# Altium schematic sheet F4_micro_FMU_REV_1.SchDoc
size A2; DrawnBy: Philip Rowse; SheetNumber: 1; SheetTotal: 10
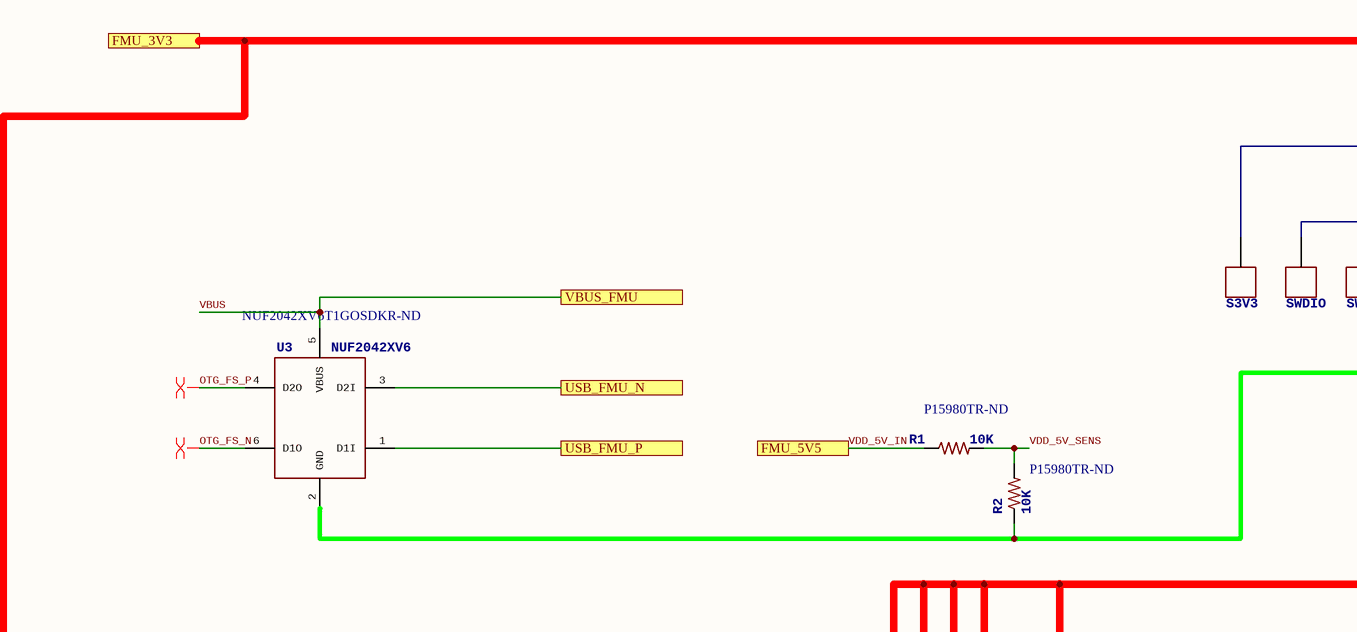
[diagram p0: F4_micro_FMU_REV_1.SchDoc, top left]
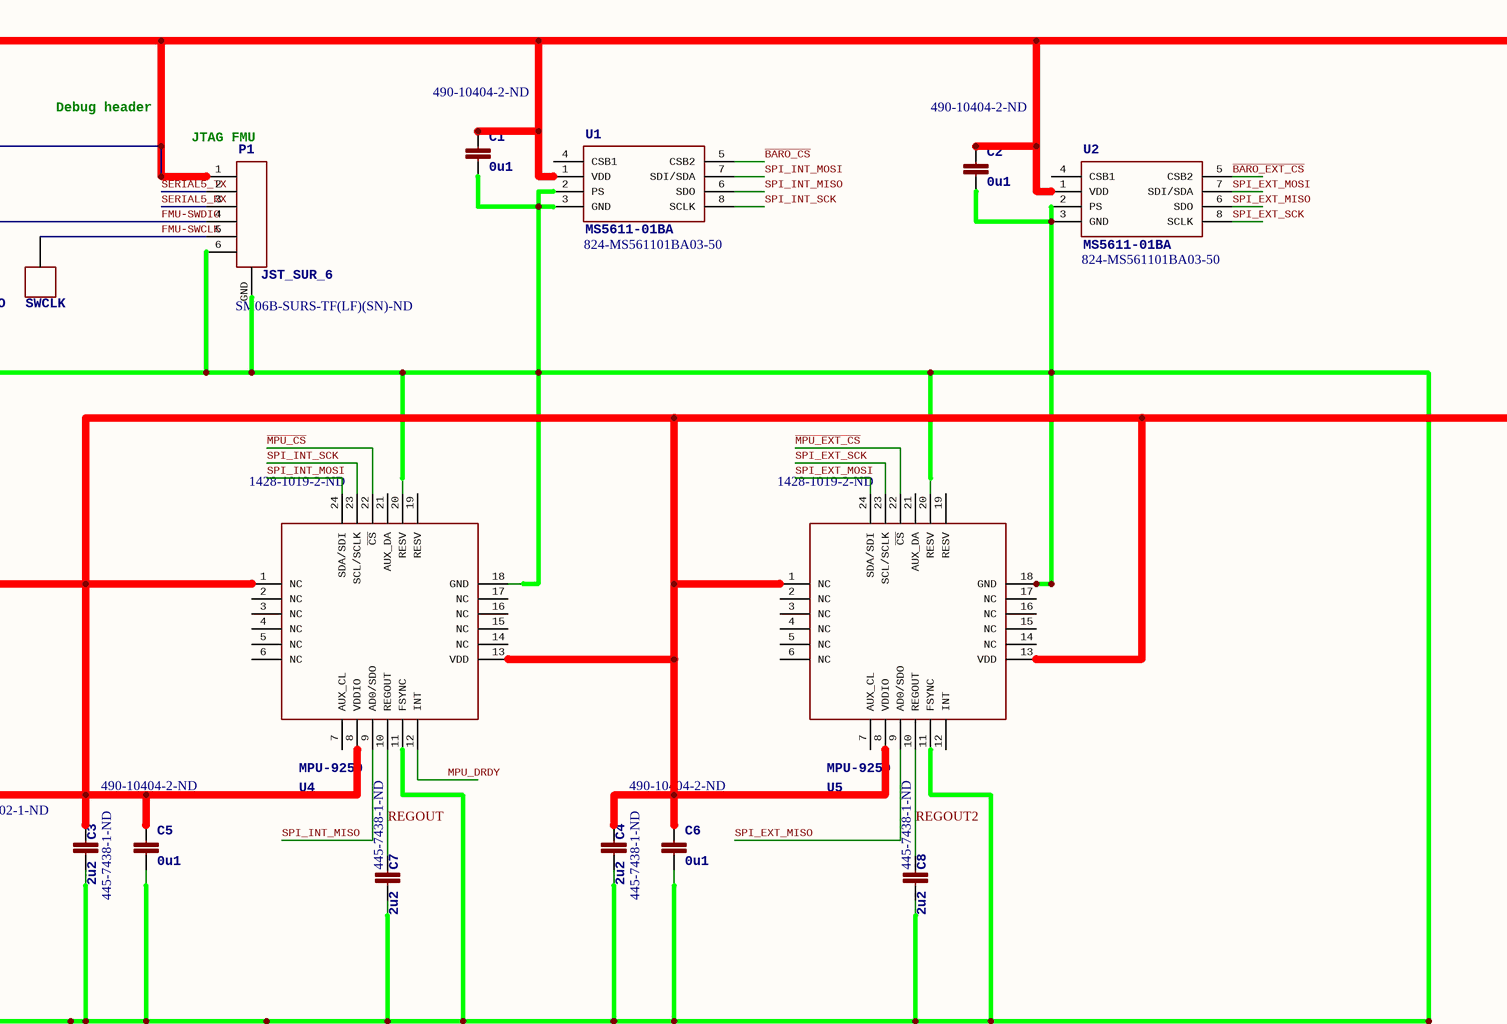
[diagram p1: F4_micro_FMU_REV_1.SchDoc, top right]
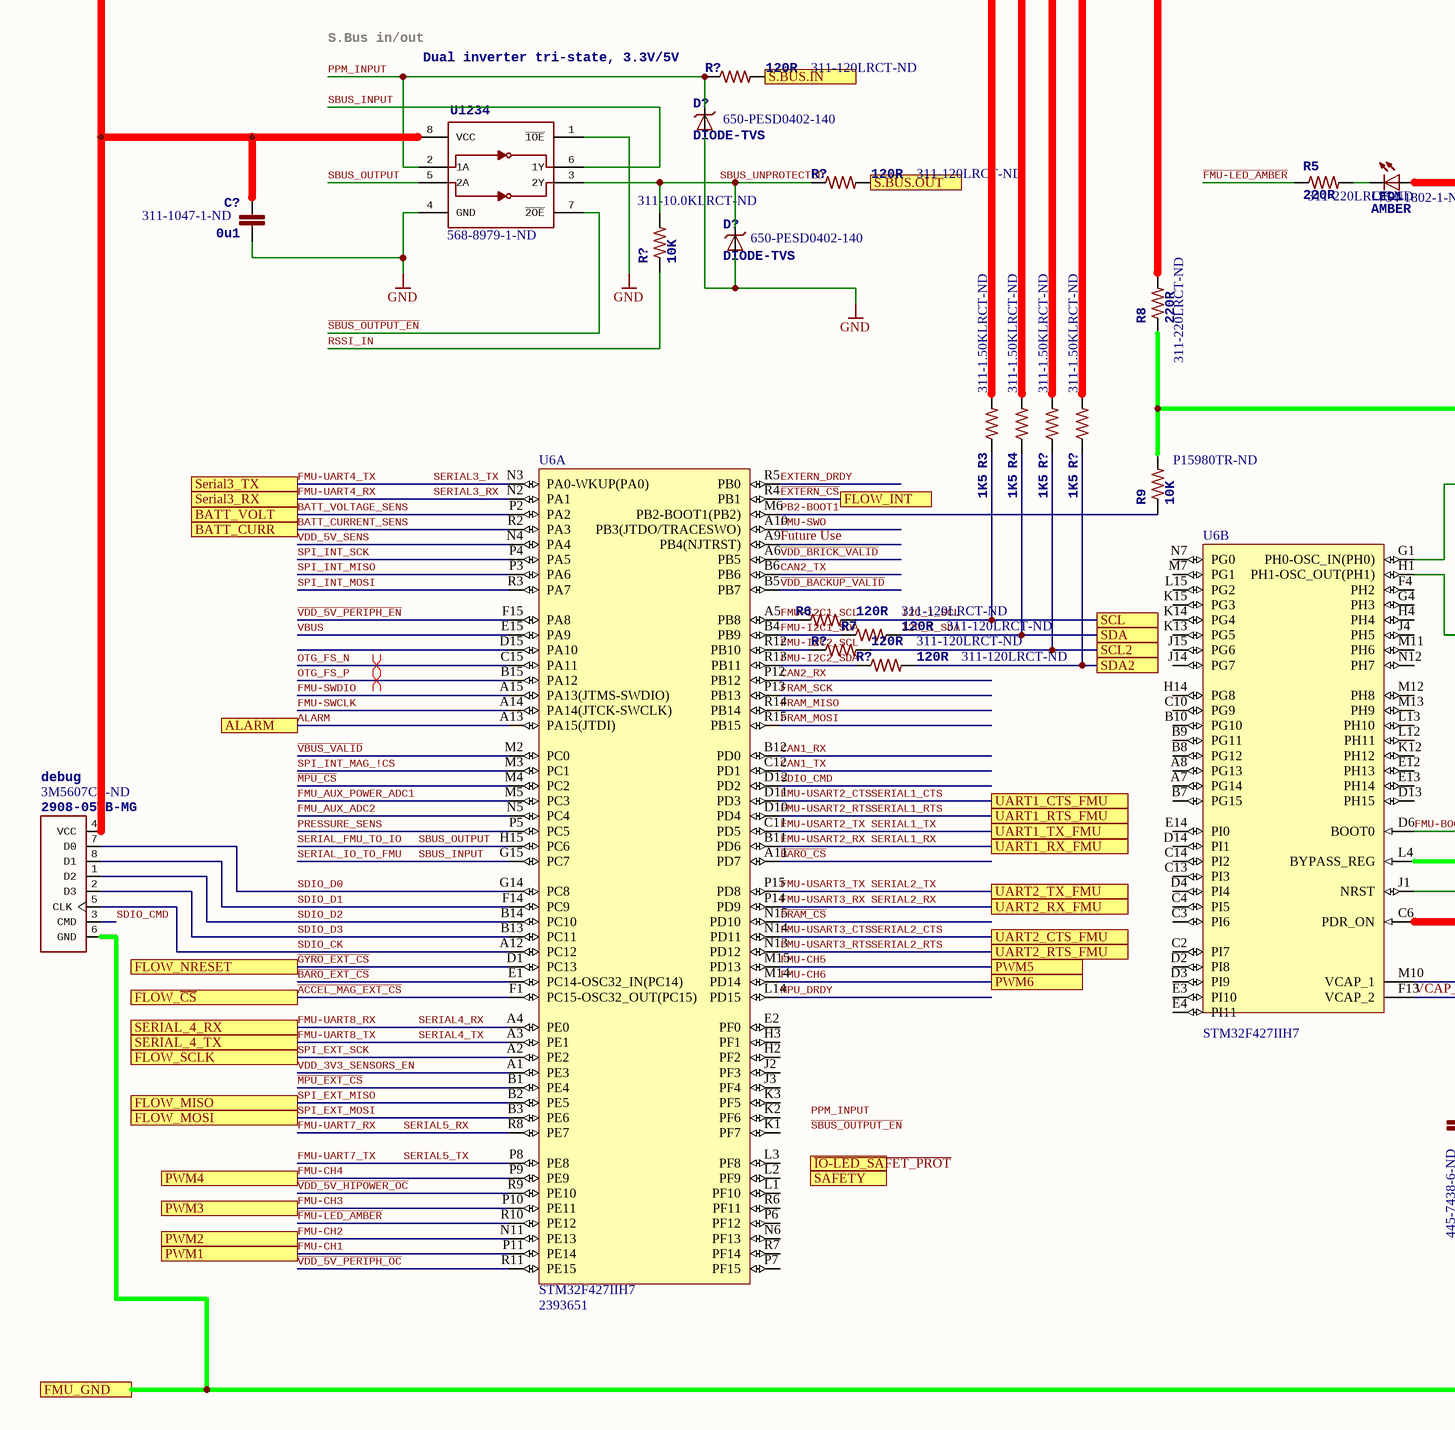
[diagram p2: F4_micro_FMU_REV_1.SchDoc, bottom left]
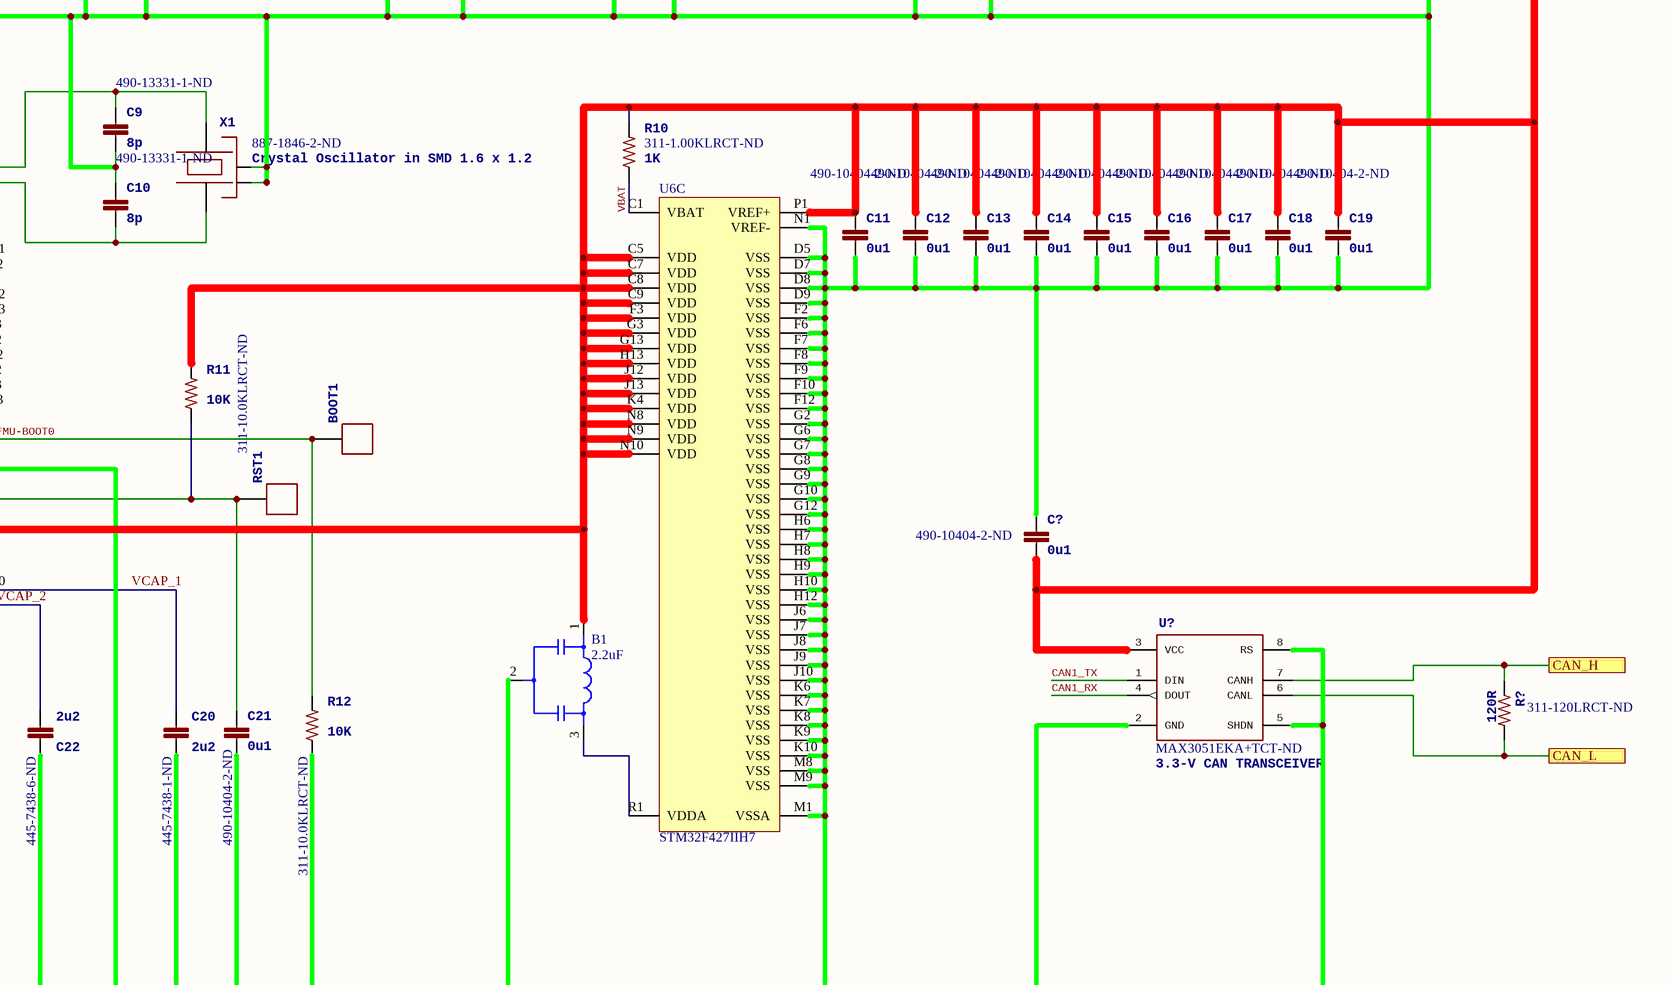
[diagram p3: F4_micro_FMU_REV_1.SchDoc, bottom right]

## Parts
(Parts that share a designator on the sheet are numbered #1, #2 ... from top to bottom, then left to right.)
B1  value 2.2uF  [NFM18CC]  (hidden comment: Filter)
BOOT1  (no value)  [PAD.04X.04]  (no BOM)
C1  0u1  Supplier Part Number 1: 490-10404-2-ND  [0201-cap]
C2  0u1  Supplier Part Number 1: 490-10404-2-ND  [0201-cap]
C3  2u2  Supplier Part Number 1: 445-7438-1-ND  [0603-CAP]
C4  2u2  Supplier Part Number 1: 445-7438-1-ND  [0603-CAP]
C5  0u1  Supplier Part Number 1: 490-10404-2-ND  [0201-cap]
C6  0u1  Supplier Part Number 1: 490-10404-2-ND  [0201-cap]
C7  2u2  Supplier Part Number 1: 445-7438-1-ND  [0603-CAP]
C8  2u2  Supplier Part Number 1: 445-7438-1-ND  [0603-CAP]
C9  8p  Supplier Part Number 1: 490-13331-1-ND  [0201-cap]
C10  8p  Supplier Part Number 1: 490-13331-1-ND  [0201-cap]
C11  0u1  Supplier Part Number 1: 490-10404-2-ND  [0201-cap]
C12  0u1  Supplier Part Number 1: 490-10404-2-ND  [0201-cap]
C13  0u1  Supplier Part Number 1: 490-10404-2-ND  [0201-cap]
C14  0u1  Supplier Part Number 1: 490-10404-2-ND  [0201-cap]
C15  0u1  Supplier Part Number 1: 490-10404-2-ND  [0201-cap]
C16  0u1  Supplier Part Number 1: 490-10404-2-ND  [0201-cap]
C17  0u1  Supplier Part Number 1: 490-10404-2-ND  [0201-cap]
C18  0u1  Supplier Part Number 1: 490-10404-2-ND  [0201-cap]
C19  0u1  Supplier Part Number 1: 490-10404-2-ND  [0201-cap]
C20  2u2  Supplier Part Number 1: 445-7438-1-ND  [0603-CAP]
C21  0u1  Supplier Part Number 1: 490-10404-2-ND  [0201-cap]
C22  2u2  Supplier Part Number 1: 445-7438-6-ND  [0603-CAP]
C?#1  0u1  Supplier Part Number 1: 311-1047-1-ND  [0402-CAP]
C?#2  0u1  Supplier Part Number 1: 490-10404-2-ND  [0201-cap]
D?#1  DIODE-TVS  Supplier Part Number 1: 650-PESD0402-140  [0402-TVS]
D?#2  DIODE-TVS  Supplier Part Number 1: 650-PESD0402-140  [0402-TVS]
debug  2908-05WB-MG  Supplier Part Number 1: 3M5607CT-ND  [MICROSD]
LED1  AMBER  Supplier Part Number 1: 754-1802-1-ND  [0603-LED]
P1  JST_SUR_6  Supplier Part Number 1: SM06B-SURS-TF(LF)(SN)-ND  [JST_SUR_H6]
R1  10K  Supplier Part Number 1: P15980TR-ND  [0201-RES]
R2  10K  Supplier Part Number 1: P15980TR-ND  [0201-RES]
R3  1K5  Supplier Part Number 1: 311-1.50KLRCT-ND  [0402-RES]
R4  1K5  Supplier Part Number 1: 311-1.50KLRCT-ND  [0402-RES]
R5  220R  Supplier Part Number 1: 311-220LRCT-ND  [0402-RES]
R6  120R  Supplier Part Number 1: 311-120LRCT-ND  [0402-RES]
R7  120R  Supplier Part Number 1: 311-120LRCT-ND  [0402-RES]
R8  220R  Supplier Part Number 1: 311-220LRCT-ND  [0402-RES]  (no BOM)
R9  10K  Supplier Part Number 1: P15980TR-ND  [0201-RES]
R10  1K  Supplier Part Number 1: 311-1.00KLRCT-ND  [0402-RES]
R11  10K  Supplier Part Number 1: 311-10.0KLRCT-ND  [0402-RES]
R12  10K  Supplier Part Number 1: 311-10.0KLRCT-ND  [0402-RES]
R?#1  120R  Supplier Part Number 1: 311-120LRCT-ND  [0402-RES]
R?#2  120R  Supplier Part Number 1: 311-120LRCT-ND  [0402-RES]
R?#3  10K  Supplier Part Number 1: 311-10.0KLRCT-ND  [0402-RES]
R?#4  1K5  Supplier Part Number 1: 311-1.50KLRCT-ND  [0402-RES]
R?#5  1K5  Supplier Part Number 1: 311-1.50KLRCT-ND  [0402-RES]
R?#6  120R  Supplier Part Number 1: 311-120LRCT-ND  [0402-RES]
R?#7  120R  Supplier Part Number 1: 311-120LRCT-ND  [0402-RES]
R?#8  120R  Supplier Part Number 1: 311-120LRCT-ND  [0402-RES]
RST1  (no value)  [PAD.04X.04]  (no BOM)
S3V3  PAD.04  [Battery Term]  (value not drawn)  (no BOM)
SWCLK  PAD.04  [Battery Term]  (value not drawn)  (no BOM)
SWDIO  PAD.04  [Battery Term]  (value not drawn)  (no BOM)
U1  MS5611-01BA  Supplier Part Number 1: 824-MS561101BA03-50  [MS5611-01BA]
U2  MS5611-01BA  Supplier Part Number 1: 824-MS561101BA03-50  [MS5611-01BA]
U3  NUF2042XV6  Supplier Part Number 1: NUF2042XV6T1GOSDKR-ND  [SOT563-6]
U4  MPU-9250  Supplier Part Number 1: 1428-1019-2-ND  [MPU-9250]
U5  MPU-9250  Supplier Part Number 1: 1428-1019-2-ND  [MPU-9250]
U6  STM32F427IIH7  Supplier Part Number 1: 2393651  [STM-UFBGA176+25]  (parts A,B,C of 3)
U1234  Dual inverter tri-state, 3.3V/5V  Supplier Part Number 1: 568-8979-1-ND  [TSSOP8_SOT505-2]
U?  3.3-V CAN TRANSCEIVER  Supplier Part Number 1: MAX3051EKA+TCT-ND  [SOT23-8]
X1  Crystal Oscillator in SMD 1.6 x 1.2  Supplier Part Number 1: 887-1846-2-ND  [OSCILLATOR-1.6x1.2]

## Ports
ALARM, BATT_CURR, BATT_VOLT, CAN_H, CAN_L, FLOW_INT, FLOW_MISO, FLOW_MOSI, FLOW_NRESET, FLOW_SCLK, FLOW_~{CS}, FMU_3V3, FMU_5V5, FMU_GND, PWM1, PWM2, PWM3, PWM4, PWM5, PWM6, S.BUS.IN, S.BUS.OUT, SAFETY, SCL, SCL2, SDA, SDA2, Serial3_RX, Serial3_TX, SERIAL_4_RX, SERIAL_4_TX, UART1_CTS_FMU, UART1_RTS_FMU, UART1_RX_FMU, UART1_TX_FMU, UART2_CTS_FMU, UART2_RTS_FMU, UART2_RX_FMU, UART2_TX_FMU, USB_FMU_N, USB_FMU_P, VBUS_FMU, ~{IO-LED_SAFET_PROT}

## Nets
GND: C?#1.P$2 D?#1.A D?#2.A U1234.1(~{1OE}) U1234.4(GND)
~{ACCEL_MAG_EXT_CS}: U6.F1(PC15-OSC32_OUT(PC15)) ; port FLOW_~{CS}
ALARM: U6.A13(PA15(JTDI)) ; port ALARM
~{BARO_CS}: U1.5(CSB2) U6.A11(PD7)
~{BARO_EXT_CS}: U2.5(CSB2) U6.E1(PC14-OSC32_IN(PC14))
BATT_CURRENT_SENS: U6.R2(PA3) ; port BATT_CURR
BATT_VOLTAGE_SENS: U6.P2(PA2) ; port BATT_VOLT
CAN1_RX: U6.B12(PD0) U?.4(DOUT)
CAN1_TX: U6.C12(PD1) U?.1(DIN)
CAN2_RX: U6.P12(PB12)
CAN2_TX: U6.B6(PB6)
CAN_H: R?#8.P$1 U?.7(CANH) ; port CAN_H
CAN_L: R?#8.P$2 U?.6(CANL) ; port CAN_L
~{EXTERN_CS}: U6.R4(PB1) ; port FLOW_INT
EXTERN_DRDY: U6.R5(PB0)
~{FMU-LED_AMBER}: R5.1 U6.R10(PE12)
~{FRAM_CS}: U6.N15(PD10)
FMU-BOOT0: BOOT1.1 R12.2 U6.D6(BOOT0)
FMU-CH1: U6.P11(PE14) ; port PWM1
FMU-CH2: U6.N11(PE13) ; port PWM2
FMU-CH3: U6.P10(PE11) ; port PWM3
FMU-CH4: U6.P9(PE9) ; port PWM4
FMU-CH5: U6.M15(PD13) ; port PWM5
FMU-CH6: U6.M14(PD14) ; port PWM6
FMU-I2C1_SCL: R6.1 U6.A5(PB8)
FMU-I2C1_SDA: R7.1 U6.B4(PB9)
FMU-I2C2_SCL: R?#6.1 U6.R12(PB10)
FMU-I2C2_SDA: R?#7.1 U6.R13(PB11)
FMU-SWCLK: P1.5 SWCLK.1 U6.A14(PA14(JTCK-SWCLK))
FMU-SWDIO: P1.4 SWDIO.1 U6.A15(PA13(JTMS-SWDIO))
FMU-SWO: U6.A10(PB3(JTDO/TRACESWO))
FMU-UART4_RX: U6.N2(PA1) ; port Serial3_RX  [also labelled SERIAL3_RX]
FMU-UART4_TX: U6.N3(PA0-WKUP(PA0)) ; port Serial3_TX  [also labelled SERIAL3_TX]
FMU-UART7_RX: P1.3 U6.R8(PE7)  [also labelled SERIAL5_RX]
FMU-UART7_TX: P1.2 U6.P8(PE8)  [also labelled SERIAL5_TX]
FMU-UART8_RX: U6.A4(PE0) ; port SERIAL_4_RX  [also labelled SERIAL4_RX]
FMU-UART8_TX: U6.A3(PE1) ; port SERIAL_4_TX  [also labelled SERIAL4_TX]
FMU-USART2_CTS: U6.D11(PD3) ; port UART1_CTS_FMU  [also labelled SERIAL1_CTS]
FMU-USART2_RTS: U6.D10(PD4) ; port UART1_RTS_FMU  [also labelled SERIAL1_RTS]
FMU-USART2_RX: U6.B11(PD6) ; port UART1_RX_FMU  [also labelled SERIAL1_RX]
FMU-USART2_TX: U6.C11(PD5) ; port UART1_TX_FMU  [also labelled SERIAL1_TX]
FMU-USART3_CTS: U6.N14(PD11) ; port UART2_CTS_FMU  [also labelled SERIAL2_CTS]
FMU-USART3_RTS: U6.N13(PD12) ; port UART2_RTS_FMU  [also labelled SERIAL2_RTS]
FMU-USART3_RX: U6.P14(PD9) ; port UART2_RX_FMU  [also labelled SERIAL2_RX]
FMU-USART3_TX: U6.P15(PD8) ; port UART2_TX_FMU  [also labelled SERIAL2_TX]
FMU_3V3: B1.1(IN) C1.1 C2.1 C3.P$1 C4.P$1 C5.1 C6.1 C11.1 C12.1 C13.1 C14.1 C15.1 C16.1 C17.1 C18.1 C19.1 C?#1.P$1 C?#2.2 debug.4(VCC) LED1.A P1.1 R3.2 R4.2 R8.2 R10.2 R11.2 R?#4.2 R?#5.2 S3V3.1 U1.1(VDD) U2.1(VDD) U4.1(NC) U4.8(VDDIO) U4.13(VDD) U5.1(NC) U5.8(VDDIO) U5.13(VDD) U6.C5(VDD) U6.C6(PDR_ON) U6.C7(VDD) U6.C8(VDD) U6.C9(VDD) U6.F3(VDD) U6.G3(VDD) U6.G13(VDD) U6.H13(VDD) U6.J12(VDD) U6.J13(VDD) U6.K4(VDD) U6.N8(VDD) U6.N9(VDD) U6.N10(VDD) U6.P1(VREF+) U1234.8(VCC) U?.3(VCC) ; port FMU_3V3
FMU_AUX_ADC2: U6.N5(PC4)
FMU_AUX_POWER_ADC1: U6.M5(PC3)
FMU_GND: B1.2(GND) C1.2 C2.2 C3.P$2 C4.P$2 C5.2 C6.2 C7.P$2 C8.P$2 C9.2 C10.1 C11.2 C12.2 C13.2 C14.2 C15.2 C16.2 C17.2 C18.2 C19.2 C20.P$2 C21.2 C22.P$1 C?#2.1 debug.6(GND) P1.6 P1.GND R2.1 R8.1 R9.2 R12.1 U1.2(PS) U1.3(GND) U2.2(PS) U2.3(GND) U3.2(GND) U4.11(FSYNC) U4.18(GND) U4.20(RESV) U5.11(FSYNC) U5.18(GND) U5.20(RESV) U6.D5(VSS) U6.D7(VSS) U6.D8(VSS) U6.D9(VSS) U6.F2(VSS) U6.F6(VSS) U6.F7(VSS) U6.F8(VSS) U6.F9(VSS) U6.F10(VSS) U6.F12(VSS) U6.G2(VSS) U6.G6(VSS) U6.G7(VSS) U6.G8(VSS) U6.G9(VSS) U6.G10(VSS) U6.G12(VSS) U6.H6(VSS) U6.H7(VSS) U6.H8(VSS) U6.H9(VSS) U6.H10(VSS) U6.H12(VSS) U6.J6(VSS) U6.J7(VSS) U6.J8(VSS) U6.J9(VSS) U6.J10(VSS) U6.K6(VSS) U6.K7(VSS) U6.K8(VSS) U6.K9(VSS) U6.K10(VSS) U6.L4(BYPASS_REG) U6.M1(VSSA) U6.M8(VSS) U6.M9(VSS) U6.N1(VREF-) U?.2(GND) U?.5(SHDN) U?.8(RS) X1.2(NC_2) X1.4(NC_4) ; port FMU_GND
FRAM_MISO: U6.R14(PB14)
FRAM_MOSI: U6.R15(PB15)
FRAM_SCK: U6.P13(PB13)
Future Use: U6.A9(PB4(NJTRST))
~{GYRO_EXT_CS}: U6.D1(PC13) ; port FLOW_NRESET
I2C_1_SCL: R3.1 R6.2 ; port SCL
I2C_1_SDA: R4.1 R7.2 ; port SDA
~{MPU_CS}: U4.22(~{CS}) U6.M4(PC2)
~{MPU_EXT_CS}: U5.22(~{CS}) U6.B1(PE4)
MPU_DRDY: U4.12(INT) U6.L14(PD15)
OTG_FS_N: U3.6(D1O) U6.C15(PA11)
OTG_FS_P: U3.4(D2O) U6.B15(PA12)
PB2-BOOT1: R9.1 U6.M6(PB2-BOOT1(PB2))
PPM_INPUT: D?#1.C R?#1.1 U1234.2(1A)
PRESSURE_SENS: U6.P5(PC5)
REGOUT: C7.P$1 U4.10(REGOUT)
REGOUT2: C8.P$1 U5.10(REGOUT)
RSSI_IN: R?#3.P$1
S.BUS.IN: R?#1.2 ; port S.BUS.IN
S.BUS.OUT: R?#2.2 ; port S.BUS.OUT
~{SBUS_OUTPUT_EN}: U1234.7(~{2OE})
SBUS_INPUT: U6.G15(PC7) U1234.6(1Y)  [also labelled SERIAL_IO_TO_FMU]
SBUS_OUTPUT: U6.H15(PC6) U1234.5(2A)  [also labelled SERIAL_FMU_TO_IO]
SBUS_UNPROTECTED: D?#2.C R?#2.1 R?#3.P$2 U1234.3(2Y)
SCL2: R?#4.1 R?#6.2 ; port SCL2
SDA2: R?#5.1 R?#7.2 ; port SDA2
SDIO_CK: debug.5(CLK) U6.A12(PC12)
SDIO_CMD: debug.3(CMD) U6.D12(PD2)
SDIO_D0: debug.7(D0) U6.G14(PC8)
SDIO_D1: debug.8(D1) U6.F14(PC9)
SDIO_D2: debug.1(D2) U6.B14(PC10)
SDIO_D3: debug.2(D3) U6.B13(PC11)
SPI_EXT_MISO: U2.6(SDO) U5.9(AD0/SDO) U6.B2(PE5) ; port FLOW_MISO
SPI_EXT_MOSI: U2.7(SDI/SDA) U5.24(SDA/SDI) U6.B3(PE6) ; port FLOW_MOSI
SPI_EXT_SCK: U2.8(SCLK) U5.23(SCL/SCLK) U6.A2(PE2) ; port FLOW_SCLK
SPI_INT_MAG_!CS: U6.M3(PC1)
SPI_INT_MISO: U1.6(SDO) U4.9(AD0/SDO) U6.P3(PA6)
SPI_INT_MOSI: U1.7(SDI/SDA) U4.24(SDA/SDI) U6.R3(PA7)
SPI_INT_SCK: U1.8(SCLK) U4.23(SCL/SCLK) U6.P4(PA5)
USB_FMU_N: U3.3(D2I) ; port USB_FMU_N
USB_FMU_P: U3.1(D1I) ; port USB_FMU_P
~{VBUS_VALID}: U6.M2(PC0)
~{VDD_5V_HIPOWER_OC}: U6.R9(PE10)
~{VDD_5V_PERIPH_EN}: U6.F15(PA8)
~{VDD_5V_PERIPH_OC}: U6.R11(PE15)
~{VDD_BACKUP_VALID}: U6.B5(PB7)
~{VDD_BRICK_VALID}: U6.A6(PB5)
VBAT: R10.1 U6.C1(VBAT)
VBUS: U3.5(VBUS) U6.E15(PA9) ; port VBUS_FMU
VCAP_1: C20.P$1 U6.M10(VCAP_1)
VCAP_2: C22.P$2 U6.F13(VCAP_2)
VDD_3V3_SENSORS_EN: U6.A1(PE3)
VDD_5V_IN: R1.1 ; port FMU_5V5
VDD_5V_SENS: R1.2 R2.2 U6.N4(PA4)
NetB1_3: B1.3(OUT) U6.R1(VDDA)
NetC9_1: C9.1 U6.G1(PH0-OSC_IN(PH0)) X1.3
NetC10_2: C10.2 U6.H1(PH1-OSC_OUT(PH1)) X1.1
NetC21_1: C21.1 R11.1 RST1.1 U6.J1(NRST)
NetLED1_C: LED1.C R5.2

Not connected (* = marked no-connect by the designer): U1 4(CSB1); U2 4(CSB1); U4 2(NC) 3(NC) 4(NC) 5(NC) 6(NC) 7(AUX_CL) 14(NC) 15(NC) 16(NC) 17(NC) 19(RESV) 21(AUX_DA); U5 2(NC) 3(NC) 4(NC) 5(NC) 6(NC) 7(AUX_CL) 12(INT) 14(NC) 15(NC) 16(NC) 17(NC) 19(RESV) 21(AUX_DA); U6 A7(PG14) A8(PG13) B7(PG15) B8(PG12) B9(PG11) B10(PG10) C2(PI7) C3(PI6) C4(PI5) C10(PG9) C13(PI3) C14(PI2) D2(PI8) D3(PI9) D4(PI4) D13(PH15) D14(PI1) D15(PA10) E2(PF0) E3(PI10) E4(PI11) E12(PH13) E13(PH14) E14(PI0) F4(PH2) G4(PH3) H2(PF2) H3(PF1) H4(PH4) H14(PG8) J2(PF3) J3(PF4) J4(PH5) J14(PG7) J15(PG6) K1(PF7) K2(PF6) K3(PF5) K12(PH12) K13(PG5) K14(PG4) K15(PG3) L1(PF10) L2(PF9) L3(PF8) L12(PH11) L13(PH10) L15(PG2) M7(PG1) M11(PH6) M12(PH8) M13(PH9) N6(PF13) N7(PG0) N12(PH7) P6(PF12) P7(PF15) R6(PF11) R7(PF14)

## Layout directives
differential pair: OTG_FS_N, OTG_FS_P

## Notes on the sheet
- Debug header
- (near P1) JTAG FMU
- S.Bus in/out
- Labels drawn without touching a wire or pin: PPM_INPUT, ~{SBUS_OUTPUT_EN}
- Title
- Size:
- Date:
- File:
- A2
- Number:
- Time:
- Revision:
- Sheet
- of

## Library data of the parts
B1 = NFM18CC222R1C3: EMIFIL (Capacitor type) Single Circuit Type for Signal Lines; PartNumber: NFM18PC225B1A3D; Manufacturer: Murata Electronics North America; Supplier 1: Digi-Key; Supplier Part Number 1: 490-6972-1-ND
BOOT1 RST1 = PAD.04: Manufacturer 1: DNF; Supplier Unit Price 1: 0; Supplier 1: DNF; Supplier Part Number 1: DNF
C1 C2 C5 C6 C11-C19 C21 C?#2 = CAP0402: CAP CER 0.1UF 6V Y5V 0201; Supplier 1: Digi-Key
C3 C4 C7 C8 = CAP0603: CAP CER 2.2UF 16V 10% X6S 0603; Supplier 1: Digi-Key
C9 C10 = CAP0402: CAP CER 8PF 50V NP0 0201; Supplier 1: Digi-Key
C20 C22 = CAP0603: Supplier 1: Digi-Key
C?#1 = CAP0402: CAP CER 0.1UF 16V Y5V 0402; PARTNO: CC0402ZRY5V7BB104; 3DR_PARTNO: ECM0700; Supplier 1: Digi-Key; Value: 0u1
D?#1 D?#2 = DIODE-TVS: TVS DIODE 14VWM 40VC 0402; 3DR_PARTNO: ECM0837; PARTNO: PESD0402-140; Value: 40v; Supplier 1: Mouser
debug = MICROSDSDI: CONN MICRO SD CARD PUSH-PUSH R/A; Supplier 1: Digi-Key
LED1 = LED0603: LED 1.6X0.8 DOME ORN CLEAR SMD; Supplier 1: Digi-Key
P1 = JST_SUR_6: Connector, Header, 6Pos, .8mm IDC, R/A, SMD, Tin; Supplier 1: Digi-Key
R1 R2 R9 = RESISTOR0402-RES: RES 10K OHM 1% 0201 SMD; Supplier 1: Digi-Key
R3 R4 R?#4 R?#5 = RESISTOR0402-RES: RES 1.5K OHM 1/16W 1% 0402 SMD; Supplier 1: Digi-Key
R5 R8 = RESISTOR0402-RES: RES 220 OHM 1/16W 1% 0402 SMD; Supplier 1: Digi-Key
R6 R7 R?#1 R?#2 R?#6 R?#7 = RESISTOR0402-RES: RES 120 OHM 1/16W 1% 0402 SMD; Supplier 1: Digi-Key
R10-R12 = RESISTOR0402-RES: Supplier 1: Digi-Key
R?#3 = RESISTOR0402-RES: RES 10K OHM 1/16W 1% 0402 SMD; PARTNO: RC0402FR-0710KL; 3DR_PARTNO: ECM0800; Supplier 1: Digi-Key; Value: 10K
R?#8 = RESISTOR0402-RES: RES 120 OHM 1/16W 1% 0402 SMD; PARTNO: RC0402FR-07120RL; 3DR_PARTNO: ECM0820; Supplier 1: Digi-Key; Value: 120R
U1 U2 = MS5611-01BA: Board Mount Pressure Sensors; Supplier 1: Mouser
U3 = NUF2042XV6: IC FILTER USB ESD PROTECT SOT363; Supplier 1: Digi-Key
U4 U5 = MPU-6500: Supplier 1: Digi-Key
U6 = STM32F427IIH7: ARM Cortex-M4 32-bit MCU+FPU, 210 DMIPS, 2048 kB Flash, 256 kB Internal RAM, 140 I/Os, 176-pin UFBGA, -40 to 105 degC, Tray; Supplier 1: Farnell
U1234 = 74LVC2G240-TSSOP-8: IC INVERTER DUAL 4-INPUT 8TSSOP; 3DR_PARTNO: ECM0817; PARTNO: 74LVC2G240DP,125; Value: INV; Supplier 1: Digi-Key
U? = MAX3051MAX3051EKA: IC TXRX CAN 1MBPS SOT23-8; 3DR_PARTNO: ECM0831; PARTNO: MAX3051EKA+T; Supplier 1: Digi-Key; Value: CAN
X1 = OSCILLATOR-3.2X2.5: CRYSTAL 24MHZ 8PF SMD; Supplier 1: Digi-Key